# Altium schematic sheet AUDIO_JACK.SchDoc
size A3; SheetNumber: 1; SheetTotal: 22
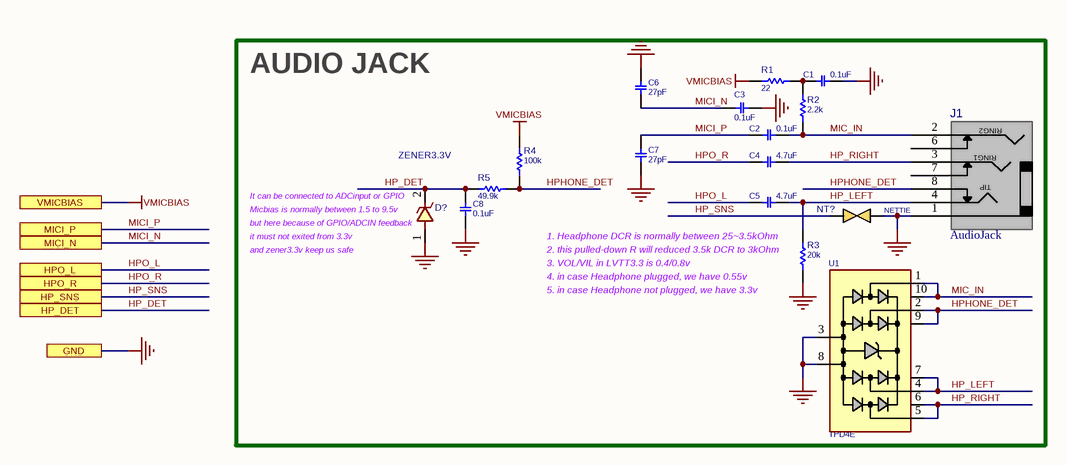
[diagram p0: AUDIO_JACK.SchDoc]

## Parts
C1  0.1uF  [C0402]
C2  0.1uF  [C0402]
C3  0.1uF  [C0402]
C4  4.7uF  [C0402]
C5  4.7uF  [C0402]
C6  27pF  [C0402]
C7  27pF  [C0402]
C8  0.1uF  [C0402]
D?  ZENER3.3V  [D_SOD523]
J1  AudioJack  [JCKAS_PJ340]
NT?  NETTIE  [NETTIE_40X50]  (net tie, no BOM)
R1  22  [R0402]
R2  2.2k  [R0402]
R3  20k  [R0402]
R4  100k  [R0402]
R5  49.9k  [R0402]
U1  TPD4E  [SON50_10_2510]

## Ports
GND, HP_DET, HP_SNS, HPO_L, HPO_R, MICI_N, MICI_P, VMICBIAS

## Nets
GND: C1.1 C3.1 C6.1 C7.2 C8.2 D?.1 J1.1(SLEEVE) NT?.2 R3.1 U1.3 U1.8 ; port GND
VMICBIAS: R1.1 R4.2 ; port VMICBIAS
HP_DET: C8.1 D?.2 R5.2 ; port HP_DET
HP_LEFT: C5.2 J1.4(TIP) R3.2 U1.4 U1.7
HP_RIGHT: C4.2 J1.3(RING1) U1.5 U1.6
HP_SNS: NT?.1 ; port HP_SNS
HPHONE_DET: J1.8(TIPSW) R4.1 R5.1 U1.2 U1.9
HPO_L: C5.1 ; port HPO_L
HPO_R: C4.1 ; port HPO_R
MIC_IN: C2.2 J1.2(RING2) R2.2 U1.1 U1.10
MICI_N: C3.2 C6.2 ; port MICI_N
MICI_P: C2.1 C7.1 ; port MICI_P
NetC1_2: C1.2 R1.2 R2.1

Not connected (* = marked no-connect by the designer): J1 6(RING2SW) 7(RING1SW)

## Notes on the sheet
- AUDIO JACK
- (near D?) It can be connected to ADCinput or GPIO
- (near D?) but here because of GPIO/ADCIN feedback
- (near D?) Micbias is normally between 1.5 to 9.5v
- (near D?) it must not exited from 3.3v
- and zener3.3v keep us safe
- 1. Headphone DCR is normally between 25~3.5kOhm
- (near R3) 2. this pulled-down R will reduced 3.5k DCR to 3kOhm
- 3. VOL/VIL in LVTT3.3 is 0.4/0.8v
- 4. in case Headphone plugged, we have 0.55v
- (near R3) 5. in case Headphone not plugged, we have 3.3v

## Library data of the parts
C1-C3 C8 = CAP_SMD_MLCC: CAP, MLCC; PARAM: X5R, 10%; MANF_P#: GRM155R61E104; MANF: Murata; PARAM2: 25v; PRICE: 10,000:	$0.006; ASSEMBLY: ASSEMBLY; VALUE: 0.1uF
C4 C5 = CAP_SMD_MLCC_100n50TDK: CAP, MLCC; PARAM: X5R, 20%; MANF_P#: CL05A475MP5NRNC; MANF: Samsung; PARAM2: 10v; ASSEMBLY: ASSEMBLY; PRICE: 10,000: $0.034; VALUE: 4.7uF
C6 C7 = CAP_SMD_MLCC: CAP, MLCC; PARAM: X5R, 10%; MANF_P#: CC0402JRNPO9BN270; MANF: Yageo; PARAM2: 10v; PRICE: 10,000: $0.034; ASSEMBLY: ASSEMBLY; VALUE: 27pF
D? = DIODE_SMD_ZENER_MM5Z12V: DIODE, ZENER, 0.2W, 12V; DESC: DESCRIPTION; PARAM: 3.4V; MANF_P#: MM5Z3V3; MANF: -; ASSEMBLY: ASSEMBLY; PRICE: PRICE; PARAM2: 0.2W; VALUE: ZENER3.3V
J1 = JACKA3.5SMD_PJ-340-SMD: Jack, Audio, Stereo, 3.5mm, RA, THD; MANF: xyfwcn; MANF_P#: PJ-340-SMD; PRICE: 0.5$; VALUE: AudioJack
NT? = NETTIE_40X50: NET TIE; MANF: -; MANF_P#: -; VALUE: NETTIE
R1-R5 = RES_SMD: RESISTOR, SMD; PARAM: 0.063W; DESC: DESCRIPTION; DIST#: MOUSER; PARAM2: 1%; MANF_P#: -; MANF: -; ASSEMBLY: ASSEMBLY; PRICE: 100= 0.3$
  R1: VALUE: 22
  R2: VALUE: 2.2k
  R3: VALUE: 20k
  R4: VALUE: 100k
  R5: VALUE: 49.9k
U1 = TVS_X4_TPD4E05U06: TVS, ESD PROTECT, 4CH,; MANF_P#: TPD4E05U06DQA; MANF: Texas Instruments; PARAM2: 6.5Vbr, 0.4pF, –40°~125°C; PARAM: ±12-kV ContactD, ±15-kVAirD; PRICE: 0.6$; VALUE: TPD4E